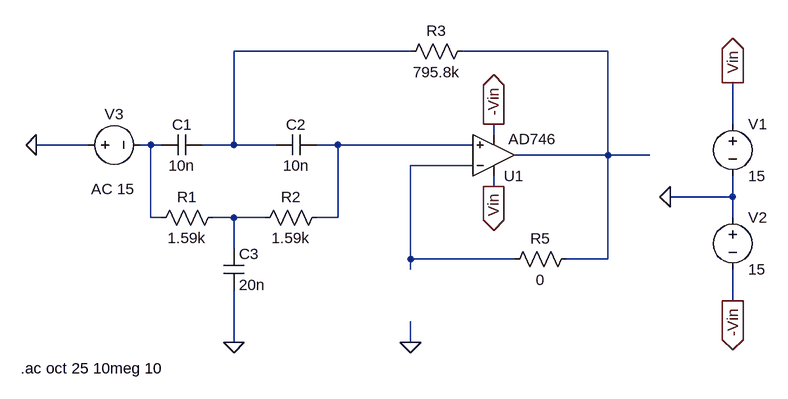
[diagram p0: schematic РФ.asc]
РФ.asc, the LTspice schematic file:
Version 4
SHEET 1 880 680
WIRE 80 16 -192 16
WIRE 384 16 160 16
WIRE 576 128 576 64
WIRE 208 144 208 128
WIRE -416 160 -496 160
WIRE -320 160 -336 160
WIRE -304 160 -320 160
WIRE -192 160 -192 16
WIRE -192 160 -240 160
WIRE -128 160 -192 160
WIRE -32 160 -64 160
WIRE 176 160 -32 160
WIRE 384 176 384 16
WIRE 384 176 240 176
WIRE 448 176 384 176
WIRE 176 192 80 192
WIRE 208 224 208 208
WIRE 576 240 576 208
WIRE 576 240 480 240
WIRE -320 272 -320 160
WIRE -304 272 -320 272
WIRE -192 272 -224 272
WIRE -144 272 -192 272
WIRE -32 272 -32 160
WIRE -32 272 -64 272
WIRE 576 272 576 240
WIRE -192 320 -192 272
WIRE 80 336 80 192
WIRE 240 336 80 336
WIRE 384 336 384 176
WIRE 384 336 320 336
WIRE 80 352 80 336
WIRE 576 400 576 352
WIRE -192 464 -192 384
WIRE 80 464 80 432
FLAG 480 240 0
FLAG 576 64 Vin
IOPIN 576 64 Out
FLAG 576 400 -Vin
IOPIN 576 400 Out
FLAG 208 224 Vin
IOPIN 208 224 Out
FLAG 208 128 -Vin
IOPIN 208 128 Out
FLAG -496 160 0
FLAG -192 464 0
FLAG 80 464 0
SYMBOL Opamps\\AD746 208 240 M180
WINDOW 3 23 89 Left 2
SYMATTR InstName U1
SYMBOL voltage 576 112 R0
SYMATTR InstName V1
SYMATTR Value 15
SYMBOL voltage 576 256 R0
SYMATTR InstName V2
SYMATTR Value 15
SYMBOL voltage -432 160 R270
WINDOW 0 32 56 VTop 2
WINDOW 3 -144 56 VBottom 2
WINDOW 123 -52 54 VBottom 2
WINDOW 39 0 0 Left 0
SYMATTR InstName V3
SYMATTR Value ""
SYMATTR Value2 AC 15
SYMBOL cap -64 144 R90
WINDOW 0 0 32 VBottom 2
WINDOW 3 32 32 VTop 2
SYMATTR InstName C2
SYMATTR Value 10n
SYMBOL res 224 352 R270
WINDOW 0 32 56 VTop 2
WINDOW 3 0 56 VBottom 2
SYMATTR InstName R5
SYMATTR Value 0
SYMBOL cap -240 144 R90
WINDOW 0 0 32 VBottom 2
WINDOW 3 32 32 VTop 2
SYMATTR InstName C1
SYMATTR Value 10n
SYMBOL res 176 0 R90
WINDOW 0 0 56 VBottom 2
WINDOW 3 32 56 VTop 2
SYMATTR InstName R3
SYMATTR Value 795.8k
SYMBOL res -48 256 R90
WINDOW 0 0 56 VBottom 2
WINDOW 3 32 56 VTop 2
SYMATTR InstName R2
SYMATTR Value 1.59k
SYMBOL res -208 256 R90
WINDOW 0 0 56 VBottom 2
WINDOW 3 32 56 VTop 2
SYMATTR InstName R1
SYMATTR Value 1.59k
SYMBOL cap -208 320 R0
SYMATTR InstName C3
SYMATTR Value 20n
TEXT -520 504 Left 2 !.ac oct 25 10meg 10

The netlist it stands for:
* РФ.asc
XU1 N004 N005 Vin -Vin N002 AD746  ; pins In+ In- V+ V- OUT
V1 Vin 0 15
V2 0 -Vin 15
V3 0 N003 AC 15
C2 N004 N001 10n
R5 N005 N002 0
C1 N001 N003 10n
R3 N002 N001 795.8k
R2 N004 N006 1.59k
R1 N006 N003 1.59k
C3 N006 0 20n
.ac oct 25 10meg 10
.backanno
.end